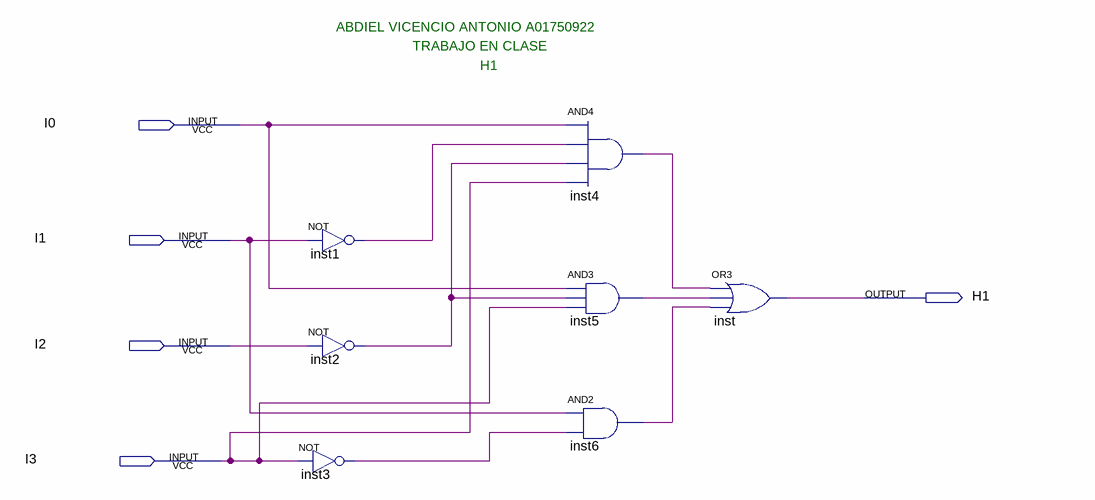
[diagram p0: schematic sheet]
// Quartus schematic H1.bdf as structural Verilog: 7 symbols, 5 pins
module H1 (
  input  I0,
  input  I1,
  input  I2,
  input  I3,
  output H1
);

  wire inst1_out, inst2_out, inst3_out, inst4_out, inst5_out, inst6_out;

  not inst1 (inst1_out, I1);
  not inst2 (inst2_out, I2);
  not inst3 (inst3_out, I3);
  and inst4 (inst4_out, I0, inst1_out, inst2_out, I3);
  and inst5 (inst5_out, I0, inst2_out, I3);
  and inst6 (inst6_out, I1, inst3_out);
  or inst (H1, inst4_out, inst5_out, inst6_out);

  // Notes on the sheet:
  //   ABDIEL VICENCIO ANTONIO A01750922
  //   TRABAJO EN CLASE
  //   H1
endmodule
